# Altium schematic sheet Sheet4.SchDoc
size A4; SheetNumber: 2; SheetTotal: 3
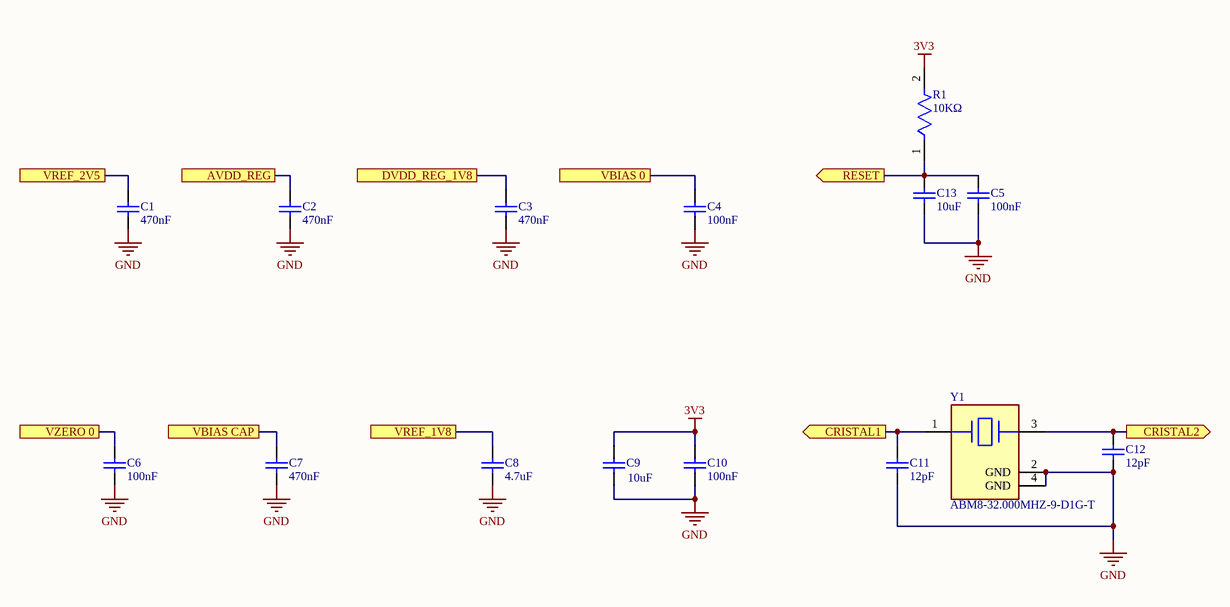
[diagram p0: Sheet4.SchDoc]

## Parts
C1  470nF  [CAPC1608X95X40LL15T15]
C2  470nF  [CAPC1608X95X40LL15T15]
C3  470nF  [CAPC1608X95X40LL15T15]
C4  100nF  [CAPC1608X95X40LL15T15]
C5  100nF  [CAPC1608X95X40LL15T15]
C6  100nF  [CAPC1608X95X40LL15T15]
C7  470nF  [CAPC1608X95X40LL15T15]
C8  4.7uF  [CAPC1608X95X40LL15T15]
C9  10uF  [CAPC1608X95X40LL15T15]
C10  100nF  [CAPC1608X95X40LL15T15]
C11  12pF  [CAPC0805(2012)100_L]
C12  12pF  [CAPC0805(2012)100_L]
C13  10uF  [CAPC1608X95X40LL15T15]
R1  10KΩ  [FP-CPF0603-MFG]
Y1  ABM8-32.000MHZ-9-D1G-T  [FP-ABM8-MFG]

## Ports
AVDD_REG (see Sheet2[1A]), CRISTAL1 (out, see Sheet2[2B]), CRISTAL2 (out, see Sheet2[2B]), DVDD_REG_1V8 (see Sheet2[1B]), RESET (out, see Sheet2[2B], Sheet2[3B]), VBIAS 0 (see Sheet2[1B]), VBIAS CAP (see Sheet2[1C]), VREF_1V8 (see Sheet2[2B]), VREF_2V5 (see Sheet2[2B]), VZERO 0 (see Sheet2[1B])

## Nets
3V3: C9.2 C10.2 R1.2
GND: C1.1 C2.1 C3.1 C4.1 C5.1 C6.1 C7.1 C8.1 C9.1 C10.1 C11.2 C12.2 C13.1 Y1.2(GND) Y1.4(GND)
AVDD_REG: C2.2 ; port AVDD_REG
CRISTAL1: C11.1 Y1.1 ; port CRISTAL1
CRISTAL2: C12.1 Y1.3 ; port CRISTAL2
DVDD_REG_1V8: C3.2 ; port DVDD_REG_1V8
RESET: C5.2 C13.2 R1.1 ; port RESET
VBIAS 0: C4.2 ; port VBIAS 0
VBIAS CAP: C7.2 ; port VBIAS CAP
VREF_1V8: C8.2 ; port VREF_1V8
VREF_2V5: C1.2 ; port VREF_2V5
VZERO 0: C6.2 ; port VZERO 0

## Library data of the parts
C1-C10 C13 = CMP-2006-01605-1: Manufacturer: Vitramon; Part Number: VJ0603G474KXQPW1BC
C11 C12 = CMP-1036-00968-1: Case-EIA: 0805; Tolerance: Â±10%; Case-Metric: 2012; Rated Voltage: 100 V; Max Thickness: 1 mm; Technology: SMT; Value: 12pF
R1 = CMP-03211-003506-1: Manufacturer: TE Connectivity; Manufacturer Part Number: CPF0603D10KE; Power Rating: 0.063W; Temperature Coefficient: 25ppm/°C; Tolerance: 0.5%; Voltage Rating: 50V; ComponentLink2Description: Datasheet; packaging: 5k Reel; Automotive: No; Octopart: https://octopart.com/cpf0603d10ke-te+connectivity-22737789; Composition: Thin Film; Value: 10KΩ; Category: Res; RoHS: TRUE; Height: 0.55mm; Lead Free: Yes; ComponentLink2URL: https://www.te.com/commerce/DocumentDelivery/DDEController?Action=showdoc&DocId=Data+Sheet%7F1773200%7FM%7Fpdf%7FEnglish%7FENG_DS_1773200_M.pdf%7F3-1676481-2; Temperature: -55°C to +155°C; Device Class L3: Chip SMD Resistors; Device Class L1: Passive Components; octopart_url: https://octopart.com/cpf0603d10ke-te+connectivity-22737789; Resistance: 10KΩ; Package: CPF0603; Temperature Range High: +155°C; Series: CPF; Temperature Range Low: -55°C; Device Class L2: Resistors; Ipc Land Pattern Name: RESC15580X45
Y1 = CMP-27762-007061-1: Crystal 32MHz ±10ppm 9pF SMD-4 3.2mm x 2.5mm